# Altium schematic sheet INDEX.SchDoc
size 420 x 297 mm; SheetNumber: 1; SheetTotal: 5
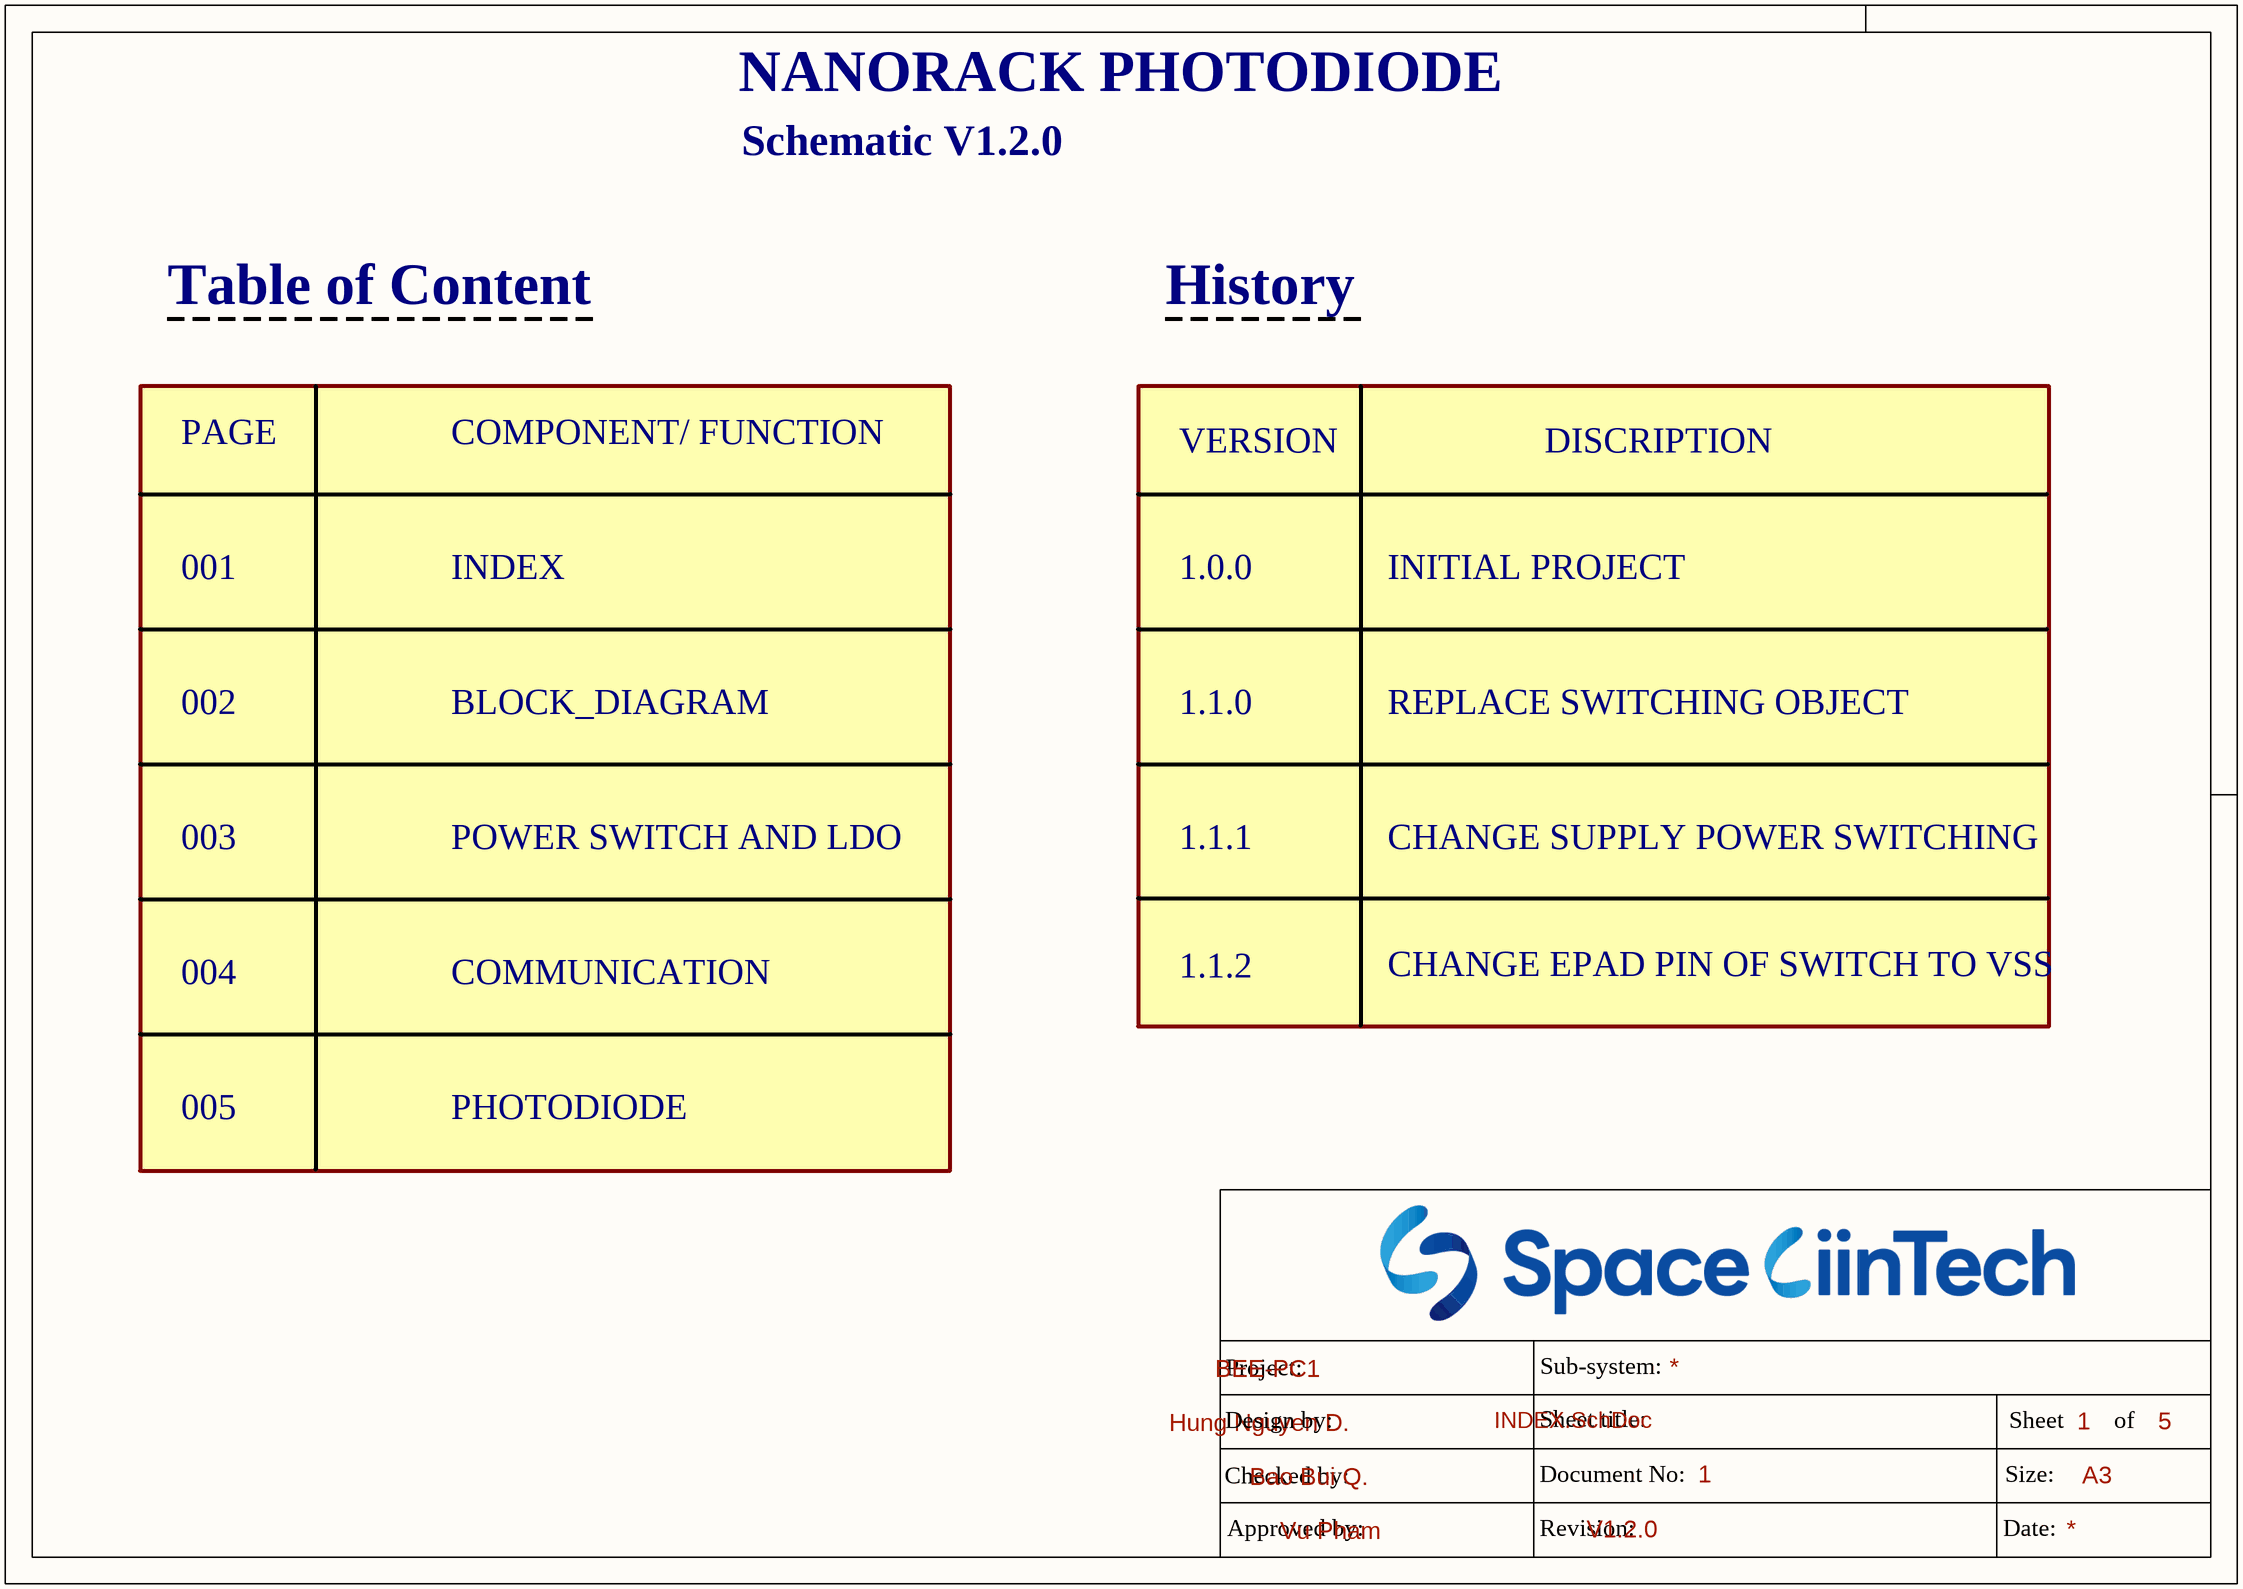
[diagram p0: INDEX.SchDoc]

## Notes on the sheet
- NANORACK PHOTODIODE
- Schematic V1.2.0
- Table of Content
- History
- PAGE
- COMPONENT/ FUNCTION
- VERSION
- DISCRIPTION
- 001
- INDEX
- 1.0.0
- INITIAL PROJECT
- 002
- BLOCK_DIAGRAM
- 1.1.0
- REPLACE SWITCHING OBJECT
- 003
- POWER SWITCH AND LDO
- 1.1.1
- CHANGE SUPPLY POWER SWITCHING
- 004
- COMMUNICATION
- 1.1.2
- CHANGE EPAD PIN OF SWITCH TO VSS
- 005
- PHOTODIODE
- Project:
- BEE-PC1
- Sub-system:
- Design by:
- Hung Nguyen D.
- Bao Bui Q.
- Sheet title:
- Sheet
- A3
- of
- Checked by:
- Approved by:
- Vu Pham
- Revision:
- Document No:
- V1.2.0
- Size:
- Date: